# EAGLE design nglight-mini (EAGLE 6.5.0)
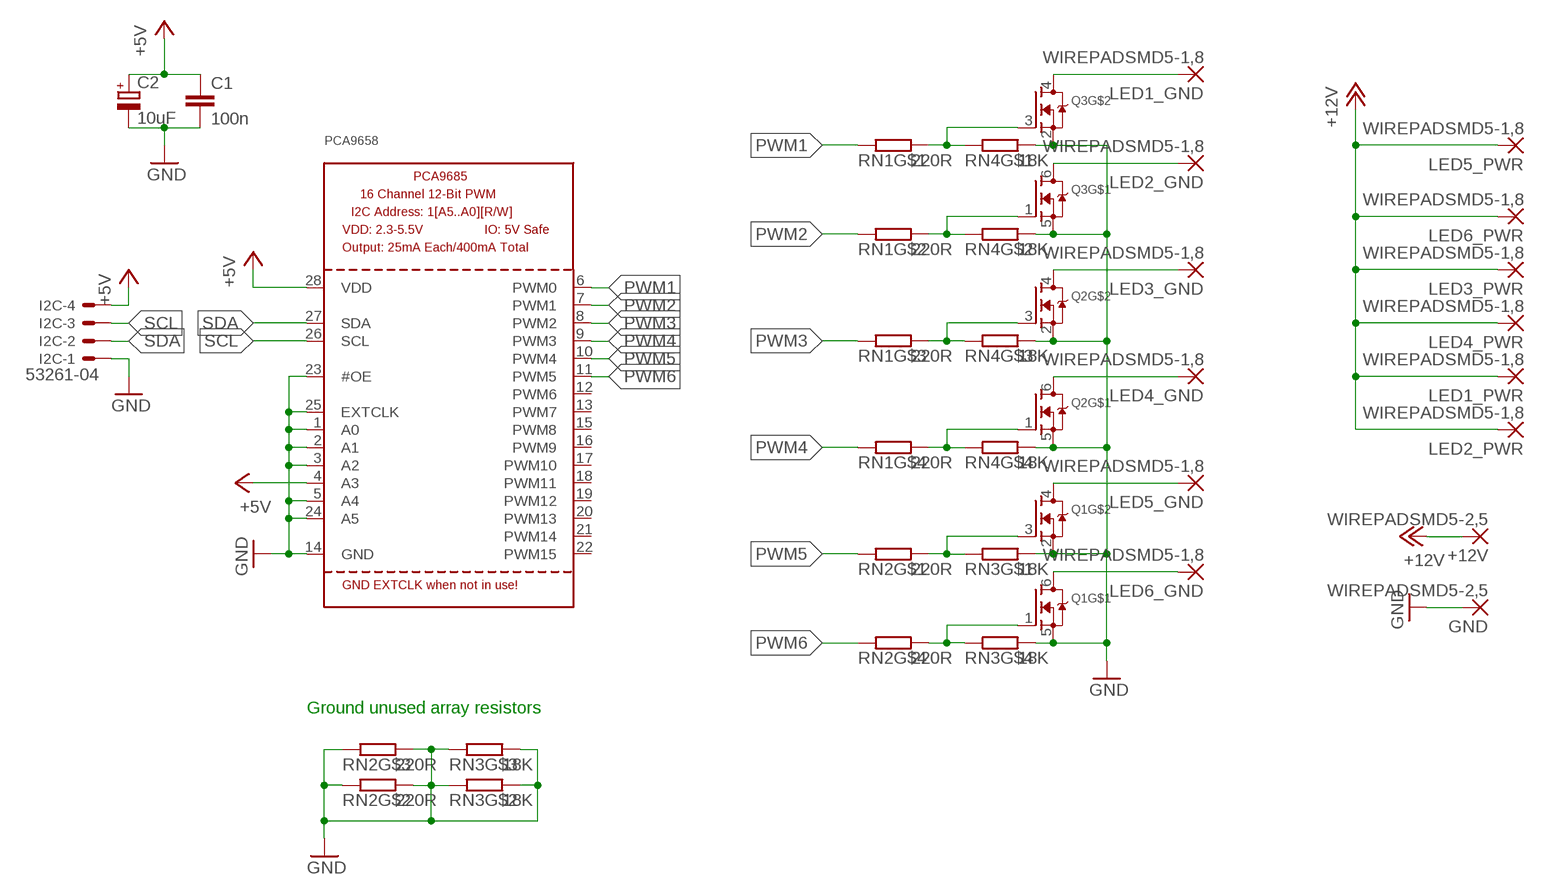
[diagram p0: schematic, sheet 1]

## Parts
+12V  WIREPADSMD5-2,5  [5-2,5]
C1  100n  C-EUC0805  [C0805]
C2  10uF  CPOL-EUUD-5X5,8  [UD-5X5,8_NICHICON]
GND  WIREPADSMD5-2,5  [5-2,5]
I2C  53261-04  [53261-04]
LED1_GND  WIREPADSMD5-1,8  [5-1,8]
LED1_PWR  WIREPADSMD5-1,8  [5-1,8]
LED2_GND  WIREPADSMD5-1,8  [5-1,8]
LED2_PWR  WIREPADSMD5-1,8  [5-1,8]
LED3_GND  WIREPADSMD5-1,8  [5-1,8]
LED3_PWR  WIREPADSMD5-1,8  [5-1,8]
LED4_GND  WIREPADSMD5-1,8  [5-1,8]
LED4_PWR  WIREPADSMD5-1,8  [5-1,8]
LED5_GND  WIREPADSMD5-1,8  [5-1,8]
LED5_PWR  WIREPADSMD5-1,8  [5-1,8]
LED6_GND  WIREPADSMD5-1,8  [5-1,8]
LED6_PWR  WIREPADSMD5-1,8  [5-1,8]
PCA9658  PCA9685  [TSSOP28]
Q1  MOSFET-N  [SOT23-6]
Q2  MOSFET-N  [SOT23-6]
Q3  MOSFET-N  [SOT23-6]
RN1  220R  4_RES_ARRAY  [0603_ARRAY_4]
RN2  220R  4_RES_ARRAY  [0603_ARRAY_4]
RN3  18K  4_RES_ARRAY  [0603_ARRAY_4]
RN4  18K  4_RES_ARRAY  [0603_ARRAY_4]

## Nets
+5V: C1.1 C2.+ I2C.4 PCA9658.4(A3) PCA9658.28(VDD)
+12V: +12V.1(P) LED1_PWR.1(P) LED2_PWR.1(P) LED3_PWR.1(P) LED4_PWR.1(P) LED5_PWR.1(P) LED6_PWR.1(P)
GND: C1.2 C2.- GND.1(P) I2C.1 PCA9658.1(A0) PCA9658.2(A1) PCA9658.3(A2) PCA9658.5(A4) PCA9658.14(GND) PCA9658.23(#OE) PCA9658.24(A5) PCA9658.25(EXTCLK) Q1.2(S) Q1.5(S) Q2.2(S) Q2.5(S) Q3.2(S) Q3.5(S) RN2.2 RN2.3 RN2.6 RN2.7 RN3.2 RN3.3 RN3.5 RN3.6 RN3.7 RN3.8 RN4.5 RN4.6 RN4.7 RN4.8
LED1: LED1_GND.1(P) Q3.4(D)
LED2: LED2_GND.1(P) Q3.6(D)
LED3: LED3_GND.1(P) Q2.4(D)
LED4: LED4_GND.1(P) Q2.6(D)
LED5: LED5_GND.1(P) Q1.4(D)
N$1: LED6_GND.1(P) Q1.6(D)
N$2: Q1.3(G) RN2.8 RN3.1
N$4: Q1.1(G) RN2.5 RN3.4
N$6: Q2.3(G) RN1.6 RN4.3
N$8: Q2.1(G) RN1.5 RN4.4
N$9: Q3.3(G) RN1.8 RN4.1
N$11: Q3.1(G) RN1.7 RN4.2
PWM1: PCA9658.6(PWM0) RN1.1
PWM2: PCA9658.7(PWM1) RN1.2
PWM3: PCA9658.8(PWM2) RN1.3
PWM4: PCA9658.9(PWM3) RN1.4
PWM5: PCA9658.10(PWM4) RN2.1
PWM6: PCA9658.11(PWM5) RN2.4
SCL: I2C.3 PCA9658.26(SCL)
SDA: I2C.2 PCA9658.27(SDA)
Unconnected: PCA9658.12(PWM6) PCA9658.13(PWM7) PCA9658.15(PWM8) PCA9658.16(PWM9) PCA9658.17(PWM10) PCA9658.18(PWM11) PCA9658.19(PWM12) PCA9658.20(PWM13) PCA9658.21(PWM14) PCA9658.22(PWM15)

## Notes on the sheet
- Ground unused array resistors

## Library data of the parts
+12V GND LED1_GND LED1_PWR LED2_GND LED2_PWR LED3_GND LED3_PWR LED4_GND LED4_PWR LED5_GND LED5_PWR LED6_GND LED6_PWR = wirepad:WIREPAD: Wire PAD connect wire on PCB
C1 = rcl:C-EU: CAPACITOR, European symbol
C2 = rcl:CPOL-EU: POLARIZED CAPACITOR, European symbol
I2C = con-molex:53?-04: CONNECTOR wire to board 1.25 mm (.049 inch) pitch header; OC_FARNELL: 1125374; OC_NEWARK: unknown
PCA9658 = adafruit:PCA9685: PCA9685 - 16 Channel 12-Bit I2C PWM Controller 5.0V tolerant 16 channel, 12-bit I2C PWM controller with 25mA per output (max. 400mA total) Digikey: 568-5931-1-ND
Q1-Q3 = dualfet:MOSFET-N: Dual N-Channel MOSFET For example: Rohm Semiconductor 2.5V Drive Nch+Nch MOS FET <http://www.digikey.com/product-detail/en/QS6K1TR/QS6K1CT-ND/721551?cur=USD> Fairchild Semiconductor Dual N-Channel 2.5V Specified PowerTrenchTM MOSFET (FDC6305N) <http://www.digikey.com/product-detail/en/FDC6305N/FDC6305NCT-ND/965582>
RN1-RN4 = r0603array:4_RES_ARRAY: SMD0603 4-resistor array with slightly longer pads (for hand soldering)

## Board
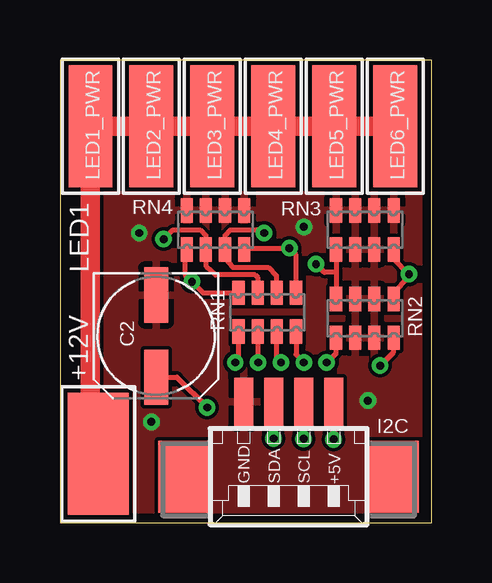
[diagram p1: board, top side]
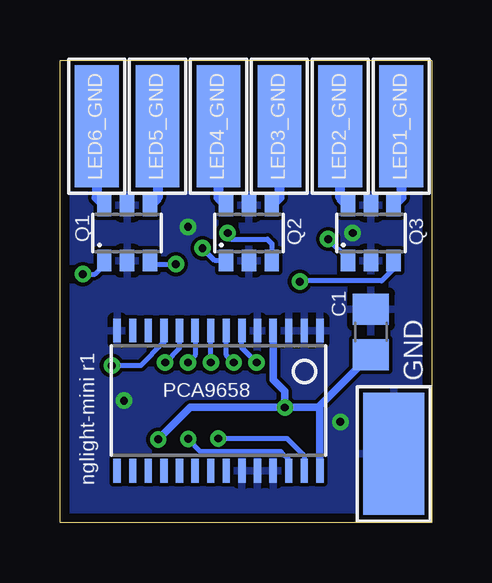
[diagram p2: board, bottom side, seen from below]

Size 15.49 x 19.27 mm. Coordinates in mm from the lower left corner, seen from the top.
Outline: 0,0 15.49,0 15.49,19.27 0,19.27 0,0
Copper layers (1*16): Top 0.0356mm / dielectric 1.5011mm / Bottom 0.0356mm
Design rules "default *": minimum track width 8mil, minimum drill 13mil, track to track 6mil, track to pad 6mil, pad to pad 6mil, via to via 6mil, smd to smd 6mil, copper to edge 15mil, drill to drill 6mil, minimum pad ring 7mil, minimum via ring 7mil, stop-mask expansion 4mil, vias tented up to drill 0mil, thermal gap 10mil
tRestrict: area 0.3,14 to 15.2,19.1
bRestrict: area 0.3,14 to 15.2,19.1

### Footprints (pad centres in the part's own frame; a part is rotated, then mirrored left to right if it is on the bottom)
5-2,5 = smd 2.54 x 5.08: 1 0,0
C0805 = smd 1.3 x 1.5: 1 -0.95,0; 2 0.95,0
UD-5X5,8_NICHICON = smd 2.3 x 1: + 1.725,0; - -1.7,0
53261-04 = smd 0.8 x 2: 1 1.875,-2.5; 2 0.625,-2.5; 3 -0.625,-2.5; 4 -1.875,-2.5 | smd 2.1 x 3: S1 4.375,0.625; S2 -4.375,0.625
5-1,8 = smd 1.829 x 5.08: 1 0,0
TSSOP28 = smd 0.305 x 0.991: 1 -4.225,-2.918; 2 -3.575,-2.918; 3 -2.925,-2.918; 4 -2.275,-2.918; 5 -1.625,-2.918; 6 -0.975,-2.918; 7 -0.325,-2.918; 8 0.325,-2.918; 9 0.975,-2.918; 10 1.625,-2.918; 11 2.275,-2.918; 12 2.925,-2.918; 13 3.575,-2.918; 14 4.225,-2.918; 15 4.225,2.918; 16 3.575,2.918; 17 2.925,2.918; 18 2.275,2.918; 19 1.625,2.918; 20 0.975,2.918; 21 0.325,2.918; 22 -0.325,2.918; 23 -0.975,2.918; 24 -1.625,2.918; 25 -2.275,2.918; 26 -2.925,2.918; 27 -3.575,2.918; 28 -4.225,2.918
SOT23-6 = smd 0.6 x 0.9: 1 -0.95,-1.15; 2 0,-1.15; 3 0.95,-1.15; 4 0.95,1.15; 5 0,1.15; 6 -0.95,1.15
0603_ARRAY_4 = smd 0.508 x 1.016: 1 -1.2,-0.81; 2 -0.4,-0.81; 3 0.4,-0.81; 4 1.2,-0.81; 5 1.2,0.81; 6 0.4,0.81; 7 -0.4,0.81; 8 -1.2,0.81

### Placement (x,y rotation side)
+12V  1.59,2.86 0 top
C1  2.54,7.94 90 bottom
C2  4,7.78 270 top
GND  1.59,2.86 180 bottom
I2C  9.53,2.54 180 top
LED1_GND  1.27,16.51 180 bottom
LED1_PWR  1.27,16.51 0 top
LED2_GND  3.81,16.51 180 bottom
LED2_PWR  3.81,16.51 0 top
LED3_GND  6.35,16.51 180 bottom
LED3_PWR  6.35,16.51 0 top
LED4_GND  8.89,16.51 180 bottom
LED4_PWR  8.89,16.51 0 top
LED5_GND  11.43,16.51 180 bottom
LED5_PWR  11.43,16.51 0 top
LED6_GND  13.97,16.51 180 bottom
LED6_PWR  13.97,16.51 0 top
PCA9658  8.89,5.08 180 bottom
Q1  12.7,12.06 0 bottom
Q2  7.62,12.06 0 bottom
Q3  2.54,12.06 0 bottom
RN1  8.64,8.76 0 top
RN2  12.7,8.51 0 top
RN3  12.7,12.19 0 top
RN4  6.48,12.19 0 top

### Tracks (layer width: path | path; a pad name or v marks a point on that pad's centre or on a via)
+5V  (via drill 0.33)
  Top 0.203: C2.+ 4.87,6.05 v6.13,4.79
  Top 0.305: I2C.4 v11.4,3.46
  Bottom 0.203: 4.67,4.73 4.73,4.79
  Bottom 0.305: PCA9658.4 6.62,5.95 6.13,5.46 v6.13,4.79 | C1.1 4.73,4.79 | 4.73,4.79 v6.13,4.79 | 4.67,4.79 4.73,4.79 | PCA9658.28 4.67,4.73 | v6.13,4.79 10.07,4.79 v11.4,3.46
+12V
  Top 0.61: +12V.1 1.27,3.17
  Top 0.813: LED6_PWR.1 LED5_PWR.1 LED4_PWR.1 LED3_PWR.1 LED2_PWR.1 LED1_PWR.1 1.27,3.17
GND  (via drill 0.33)
  other vias: 12.83,5.08 10.16,12.32 3.3,12.06 3.81,4.19
  pour Top: -1.27,-1.27 -1.27,20.19 16.26,20.19 16.26,-1.27
  pour Bottom: -1.27,-1.27 -1.27,20.19 16.26,20.19 16.26,-1.27
LED1
  Bottom 0.406: Q3.4 1.27,13.54 LED1_GND.1
LED2
  Bottom 0.406: Q3.6 3.81,13.54 LED2_GND.1
LED3
  Bottom 0.406: LED3_GND.1 6.35,13.54 Q2.4
LED4
  Bottom 0.406: LED4_GND.1 8.89,13.54 Q2.6
LED5
  Bottom 0.406: LED5_GND.1 11.43,13.54 Q1.4
N$1
  Bottom 0.406: LED6_GND.1 13.97,13.54 Q1.6
N$2  (via drill 0.33)
  Top 0.203: RN3.1 11.5,10.42 | 11.5,10.42 RN2.8 | 11.5,10.42 11.01,10.42 v10.67,10.76
  Bottom 0.203: Q1.3 11.6,10.76 v10.67,10.76
N$4  (via drill 0.33)
  Top 0.203: RN3.4 | RN2.5 13.9,9.58 14.54,10.22 v14.54,10.35 13.9,10.99 RN3.4 | 13.9,11.12 RN3.4
  Bottom 0.203: v14.54,10.35 14.03,10.35 13.65,10.73 Q1.1
N$6  (via drill 0.33)
  Top 0.203: 9.04,10.01 RN1.6 9.02,9.59 9.02,10.29 8.67,10.64 7.21,10.64 6.88,11 RN4.3 | RN4.3 6.86,11.4 | RN4.3 6.88,11.96 7.11,12.19 8.38,12.19 v8.51,12.06
  Bottom 0.152: 6.67,10.79 Q2.3
  Bottom 0.203: v8.51,12.06 8.51,11.94 8.38,11.81 6.86,11.81 6.67,11.62 Q2.3
N$8  (via drill 0.33)
  Top 0.203: RN1.5 9.84,11.15 v9.56,11.43 7.72,11.43
  Top 0.254: 7.72,11.43 RN4.4
  Bottom 0.203: Q2.1 9.04,10.91 v9.56,11.43
N$9  (via drill 0.33)
  Top 0.203: 7.35,9.4 RN1.8 | 7.27,9.4 RN1.8 | 5.21,11.31 5.21,10.33 v5.5,10.04 5.97,9.57 RN1.8
  Top 0.254: RN4.1 5.21,11.31
  Bottom 0.203: 1.59,10.57 2.06,10.1 2.1,10.06 5.47,10.06 v5.5,10.04
  Bottom 0.254: 1.59,10.79 Q3.3 1.59,10.57
N$11  (via drill 0.33)
  Top 0.152: 6.1,11.36 RN4.2
  Top 0.203: 8.24,9.8 RN1.7 8.24,10.21 8.13,10.32 6.48,10.32 6.1,10.67 6.1,11.36 | RN4.2 6.08,11.96 5.84,12.19 4.7,12.19 v4.32,11.81
  Bottom 0.203: v4.32,11.81 3.49,10.98 Q3.1
PWM1  (via drill 0.33)
  Top 0.203: RN1.1 7.44,6.8 v7.3,6.67
  Bottom 0.203: v7.3,6.67 7.92,7.28 PCA9658.6
PWM2  (via drill 0.33)
  Top 0.203: v8.26,6.67 8.26,7.68 RN1.2
  Bottom 0.203: v8.26,6.67 8.56,6.98 PCA9658.7
PWM3  (via drill 0.33)
  Top 0.203: v9.21,6.67 9.04,6.84 RN1.3
  Bottom 0.203: v9.21,6.67 PCA9658.8
PWM4  (via drill 0.33)
  Top 0.203: RN1.4 9.84,6.99 v10.16,6.67
  Bottom 0.203: 10.09,6.74 v10.16,6.67 9.87,6.96 PCA9658.9
PWM5  (via drill 0.33)
  Top 0.203: v11.11,6.67 11.5,7.05 RN2.1
  Bottom 0.203: PCA9658.10 10.52,7.26 v11.11,6.67
PWM6  (via drill 0.33)
  Top 0.203: v13.34,6.54 13.9,7.11 RN2.4
  Bottom 0.203: PCA9658.11 11.16,7.5 12.13,6.54 v13.34,6.54
SCL  (via drill 0.33)
  Top 0.203: I2C.3 v10.15,3.48
  Bottom 0.203: 5.96,2.47 PCA9658.26 5.96,2.63 6.29,2.95 9.62,2.95 v10.15,3.48
SDA  (via drill 0.33)
  Top 0.203: I2C.2 v8.9,3.5
  Bottom 0.203: PCA9658.27 5.32,2.77 6.04,3.5 v8.9,3.5

### Text on the board
tNames: LED1 | GND | SDA | SCL | +5V
bNames: nglight-mini r1